# Altium schematic sheet main.SchDoc
size A4
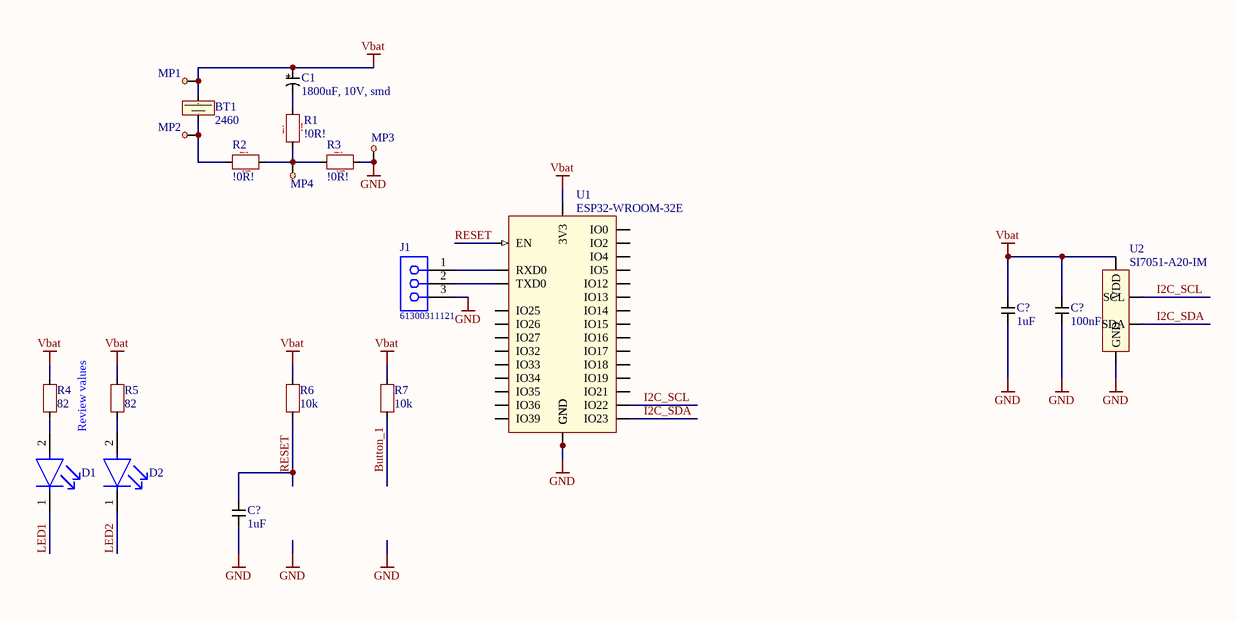
[diagram p0: main.SchDoc]

## Parts
(Parts that share a designator on the sheet are numbered #1, #2 ... from top to bottom, then left to right.)
BT1  2460  [KEYSTONE_2410]
C1  1800uF, 10V, smd  [Rubycon_TRV_12.5mmx13.5mm]
C?#1  1uF  [C1206]
C?#2  100nF  [C1206]
C?#3  1uF  [C1206]
D1  red led  [Kingbright_KPT-2012EC_0]  (value not drawn)
D2  red led  [Kingbright_KPT-2012EC_0]  (value not drawn)
J1  61300311121  [61300311121]
MP1  Measure_point  [MeasurePoint_1.5mm]  (value not drawn)  (no BOM)
MP2  Measure_point  [MeasurePoint_1.5mm]  (value not drawn)  (no BOM)
MP3  Measure_point  [MeasurePoint_1.5mm]  (value not drawn)  (no BOM)
MP4  Measure_point  [MeasurePoint_1.5mm]  (value not drawn)  (no BOM)
R1  !0R!  [R1206_SHORTED_REMOVABLE]
R2  !0R!  [R1206_SHORTED_REMOVABLE]
R3  !0R!  [R1206_SHORTED_REMOVABLE]
R4  82  [R1206_Simple-Assemble]
R5  82  [R1206_Simple-Assemble]
R6  10k  [R1206_Simple-Assemble]
R7  10k  [R1206_Simple-Assemble]
U1  ESP32-WROOM-32E  [ESP32­WROOM­32E]
U2  SI7051-A20-IM  [3x3 6-pin DFN]

## Nets
GND: C?#1.1 C?#2.1 C?#3.1 J1.3 MP3.1 R3.2 U1.1(GND) U1.15(GND) U1.38(GND) U2.2(GND)
Vbat: BT1.1(+) C1.1(+) C?#1.2 C?#2.2 MP1.1 R4.2 R5.2 R6.2 R7.2 U1.2(3V3) U2.5(VDD)
Button_1: R7.1
I2C_SCL: U1.36(IO22) U2.6(SCL)
I2C_SDA: U1.37(IO23) U2.1(SDA)
LED1: D1.1(C)
LED2: D2.1(C)
RESET: C?#3.2 R6.1 U1.3(EN)
NetBT1_2: BT1.2(-) MP2.1 R2.1
NetC1_2: C1.2(-) R1.1
NetD1_2: D1.2(A) R4.1
NetD2_2: D2.2(A) R5.1
NetJ1_1: J1.1 U1.34(RXD0)
NetJ1_2: J1.2 U1.35(TXD0)
NetMP4_1: MP4.1 R1.2 R2.2 R3.1

Not connected (* = marked no-connect by the designer): U1 4(IO36) 5(IO39) 6(IO34) 7(IO35) 8(IO32) 9(IO33) 10(IO25) 11(IO26) 12(IO27) 13(IO14) 14(IO12) 16(IO13) 17(NC) 18(NC) 19(NC) 20(NC) 21(NC) 22(NC) 23(IO15) 24(IO2) 25(IO0) 26(IO4) 27(IO16) 28(IO17) 29(IO5) 30(IO18) 31(IO19) 32(NC) 33(IO21)

## Notes on the sheet
- Review values
- (in symbol 0R, optional resistor) !

## Library data of the parts
BT1 = 2460: Battery Holder, AA x 1, Through Hole; Brand: KEYSTONE; Farnell_Price: 1,80; Type: 2460; Farnell_Order_Code: 1702629; Mouser_Price: 1,10; Mouser_Order_Code: 534-2460
C1 = 1800uF, 10V, smd: SMD Aluminium Electrolytic Capacitor, Radial Can, 1800 µF, 10 V, 0.092 ohm, TRV Series; Brand: RUBYCON; Type: 10TRV1800M12.5X13.5; Order Code: 2535761; Capacitance: 1800µF; Price: 0,436; Supplier: Farnell; Voltage: 10V
C?#1 C?#3 = 1uF,1206: 1uF, 1206; Capacitance: 1uF; Brand: *; Order Code: *; Type: *
C?#2 = 100nF,1206: 100nF, 1206; Capacitance: 100nF; Brand: *; Order Code: *; Type: *
D1 D2 = KPT-2012EC: KPT-2012EC -  LED, Low Power, Red, SMD, 0805 [2012 Metric], 30 mA, 2 V, 617 nm; Brand: KINGBRIGHT; Order Code: 2099236; Type: KPT-2012EC; Supplier: Farnell; Price: 0,112
J1 = 61300311121: Board-To-Board Connector, Vertical, 2.54 mm, 3 Contacts, Header, WR-PHD Series, Through Hole; Pitch: 2.54 mm; Gender: Male; Order Code: 2356154; Brand: WURTH ELEKTRONIK; ComponentLink1Description: Manufacturer; ComponentLink1URL: http://www.we-online.de; ComponentLink2Description: Datasheet; ComponentLink2URL: https://katalog.we-online.de/em/datasheet/6130xx21821.pdf; Mounting Technology: THT; Orientation: Vertical; Supplier: Farnell; Price: 0,06; Type: 61300311121
MP1-MP4 = Measure_point: Measurepoint
R1-R3 = 0R, optional resistor: normally shorted, but easy to change to an resistor footprint
R4 R5 = 82, 1206: SMD Chip Resistor, 82 ohm, ± 1%, 250 mW, 1206 [3216 Metric], Thick Film, General Purpose; Brand: MULTICOMP; Order Code: 2447546; Power: 250mW; Resistance: 82; Type: MCWR12X82R0FTL; Supplier: Farnell; Price: 0,0149
R6 R7 = 10k, 1206: 10k, 1206, 250mW, 200V; Brand: TE CONNECTIVITY; Order Code: 2861956; Resistance: 10k; Power: 250mW; Type: CRGCQ1206J10K; Supplier: Farnell; Price: 0,0139
U1 = ESP32-WROOM-32E(M113EH2800PH3Q0): USB-modules (802.11) SMD Module ESP32-WROOM-32E, ESP32-D0WD-V3, 16 MB SPI flash, PCB antenna; Brand: Espressif Systems; Order Code: 356-ESP32WRM32E128PH; Type: ESP32-WROOM-32E; Price: 2,64; Supplier: MOUSER
U2 = SI7051-A20-IM: Temperature Sensor IC, Digital, ± 0.1°C, -40 °C, 125 °C, DFN, 6 Pins; Brand: SILICON LABS; Order Code: 2769160; Type: SI7051-A20-IM; Price: 1,98; Supplier: Farnell; ClassName: Smallpitch